# Altium schematic sheet S1_LED_MAT_HDMI.SCHDOC: HDMI Input
size A3; DrawnBy: KSN; Engineer: Dim Su; Revision: 2.0; SheetNumber: 2; SheetTotal: 7; ContentRev1: Original Document; dateREV1: "Aug/09/2018"; dateREV2: "Aug/31/2018"; ContentRev2: ESD circuit changed; Rev1: V1; Rev2: V2; Project: LED_MAT3
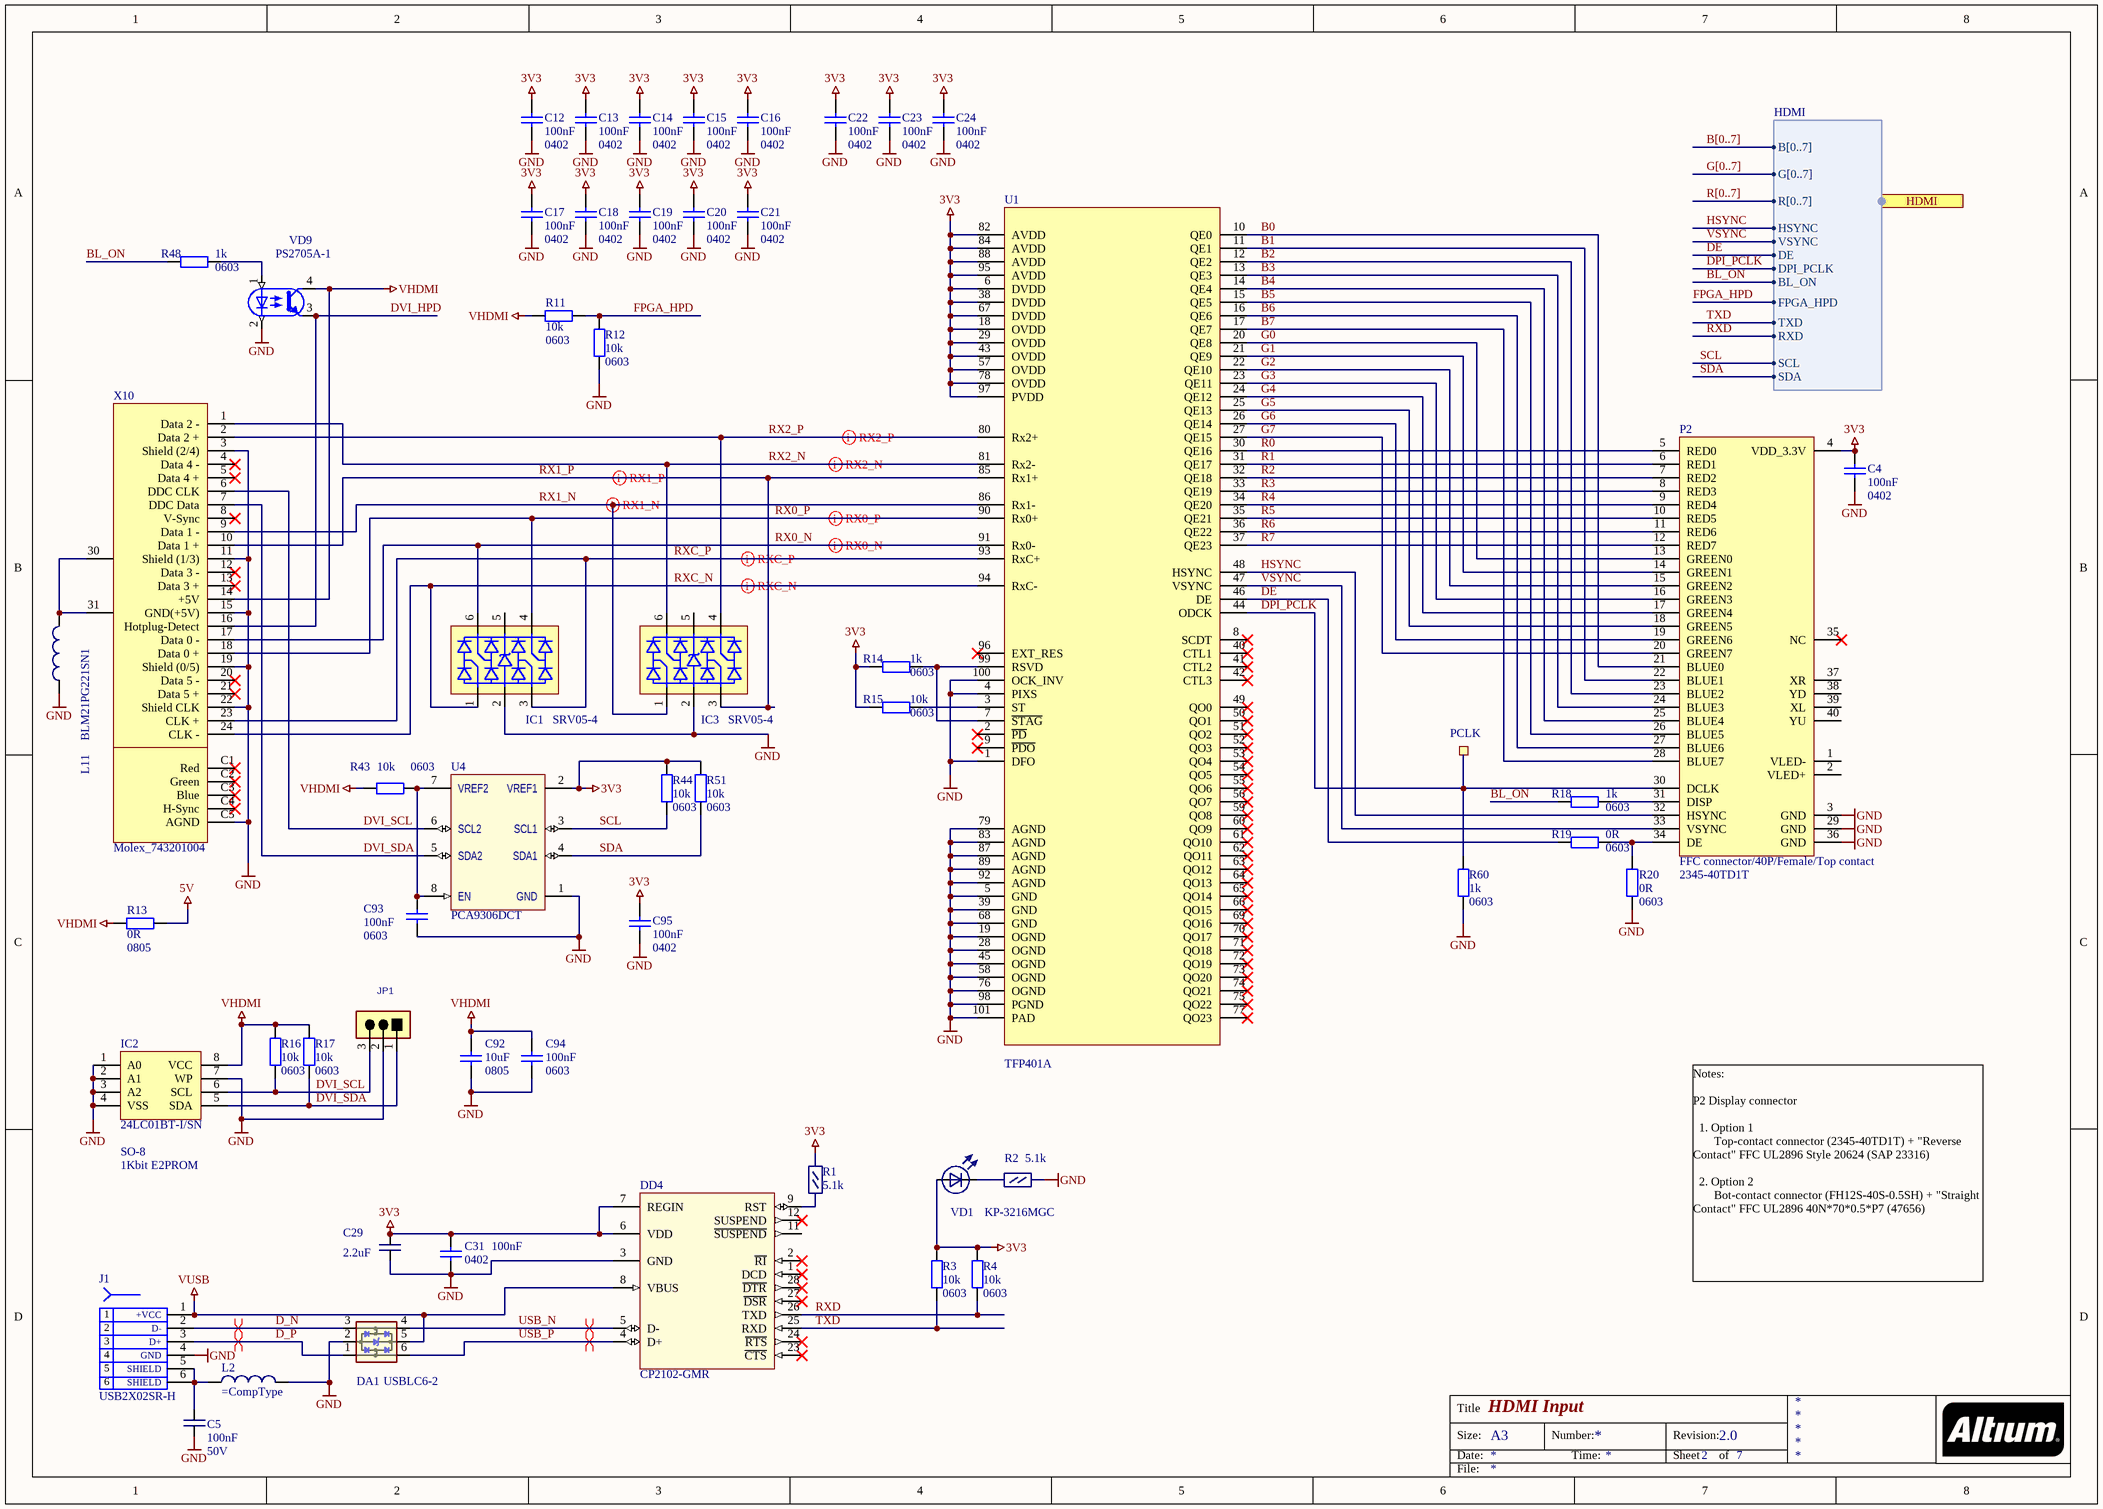
[diagram p0: S1_LED_MAT_HDMI.SCHDOC]

## Parts
C4  value 100nF  Package: 0402  [CAPC1005L]  (hidden comment: 100nF / 0402 / X7R / 16V)
C5  100nF  Voltage: 50V  [CAPC1608L]
C12  value 100nF  Package: 0402  [CAPC1005L]  (hidden comment: 100nF / 0402 / X7R / 16V)
C13  value 100nF  Package: 0402  [CAPC1005L]  (hidden comment: 100nF / 0402 / X7R / 16V)
C14  value 100nF  Package: 0402  [CAPC1005L]  (hidden comment: 100nF / 0402 / X7R / 16V)
C15  value 100nF  Package: 0402  [CAPC1005L]  (hidden comment: 100nF / 0402 / X7R / 16V)
C16  value 100nF  Package: 0402  [CAPC1005L]  (hidden comment: 100nF / 0402 / X7R / 16V)
C17  value 100nF  Package: 0402  [CAPC1005L]  (hidden comment: 100nF / 0402 / X7R / 16V)
C18  value 100nF  Package: 0402  [CAPC1005L]  (hidden comment: 100nF / 0402 / X7R / 16V)
C19  value 100nF  Package: 0402  [CAPC1005L]  (hidden comment: 100nF / 0402 / X7R / 16V)
C20  value 100nF  Package: 0402  [CAPC1005L]  (hidden comment: 100nF / 0402 / X7R / 16V)
C21  value 100nF  Package: 0402  [CAPC1005L]  (hidden comment: 100nF / 0402 / X7R / 16V)
C22  value 100nF  Package: 0402  [CAPC1005L]  (hidden comment: 100nF / 0402 / X7R / 16V)
C23  value 100nF  Package: 0402  [CAPC1005L]  (hidden comment: 100nF / 0402 / X7R / 16V)
C24  value 100nF  Package: 0402  [CAPC1005L]  (hidden comment: 100nF / 0402 / X7R / 16V)
C29  2.2uF  [CAPC2012L]
C31  value 100nF  Package: 0402  [CAPC1005L]  (hidden comment: 100nF / 0402 / X7R / 16V)
C92  value 10uF  Package: 0805  [CAPC2012L]  (hidden comment: 10uF / 0805 /  X5R / 10V)
C93  value 100nF  Package: 0603  [CAPC1608L]  (hidden comment: 100nF / 0603 / X7R / 16V)
C94  value 100nF  Package: 0603  [CAPC1608L]  (hidden comment: 100nF / 0603 / X7R / 16V)
C95  value 100nF  Package: 0402  [CAPC1005L]  (hidden comment: 100nF / 0402 / X7R / 16V)
DA1  USBLC6-2  [SOT95P280X110-6L]
DD4  CP2102-GMR  [QFN50P500X500-28V1N]
IC1  value SRV05-4  [SOT23-6 (DBV)]  (hidden comment: SRV05-4.TCT/5V/300W/TVS Diode Array)
IC2  value 1Kbit E2PROM  Manufacturer Part Number: 24LC01BT-I/SN  Package: SO-8  [SOIC127P600-8N]  (hidden comment: 24LC01B)
IC3  value SRV05-4  [SOT23-6 (DBV)]  (hidden comment: SRV05-4.TCT/5V/300W/TVS Diode Array)
J1  USB2X02SR-H  [USB_B]
JP1  Header 1x3, 2.54mm  [HDR-1x3 SAP 10347]  (value not drawn)
L2  (no value)  [INDC2012L]
L11  BLM21PG221SN1  [INDC2012L]
P2  value FFC connector/40P/Female/Top contact  Manufacturer Part Number: 2345-40TD1T  [OUPIN 2345-40]  (hidden comment: TIANMA_TM043NBH02)
PCLK  Ø1.0mm,SMD  [TP_SMD_1MM]  (value not drawn)  (no BOM)
R1  5.1k  [RESC1608L]
R2  5.1k  [RESC1608L]
R3  value 10k  Package: 0603  [RESC1608L]  (hidden comment: 10k / 1% / 0603 / TC100 / 50V / 0.1W)
R4  value 10k  Package: 0603  [RESC1608L]  (hidden comment: 10k / 1% / 0603 / TC100 / 50V / 0.1W)
R11  value 10k  Package: 0603  [RESC1608L]  (hidden comment: 10k / 1% / 0603 / TC100 / 50V / 0.1W)
R12  value 10k  Package: 0603  [RESC1608L]  (hidden comment: 10k / 1% / 0603 / TC100 / 50V / 0.1W)
R13  value 0R  Package: 0805  [RESC2012L]  (hidden comment: 0R / 2A / 0805/ TC100 / 50V / 0.125W)
R14  value 1k  Package: 0603  [RESC1608L]  (hidden comment: 1k / 1% / 0603 / TC100 / 50V / 0.1W)
R15  value 10k  Package: 0603  [RESC1608L]  (hidden comment: 10k / 1% / 0603 / TC100 / 50V / 0.1W)
R16  value 10k  Package: 0603  [RESC1608L]  (hidden comment: 10k / 1% / 0603 / TC100 / 50V / 0.1W)
R17  value 10k  Package: 0603  [RESC1608L]  (hidden comment: 10k / 1% / 0603 / TC100 / 50V / 0.1W)
R18  value 1k  Package: 0603  [RESC1608L]  (hidden comment: 1k / 1% / 0603 / TC100 / 50V / 0.1W)
R19  value 0R  Package: 0603  [RESC1608L]  (hidden comment: 0R / 1A / 0603 / TC100 / 50V / 0.1W)
R20  value 0R  Package: 0603  [RESC1608L]  (hidden comment: 0R / 1A / 0603 / TC100 / 50V / 0.1W)
R43  value 10k  Package: 0603  [RESC1608L]  (hidden comment: 10k / 1% / 0603 / TC100 / 50V / 0.1W)
R44  value 10k  Package: 0603  [RESC1608L]  (hidden comment: 10k / 1% / 0603 / TC100 / 50V / 0.1W)
R48  value 1k  Package: 0603  [RESC1608L]  (hidden comment: 1k / 1% / 0603 / TC100 / 50V / 0.1W)
R51  value 10k  Package: 0603  [RESC1608L]  (hidden comment: 10k / 1% / 0603 / TC100 / 50V / 0.1W)
R60  value 1k  Package: 0603  [RESC1608L]  (hidden comment: 1k / 1% / 0603 / TC100 / 50V / 0.1W)
U1  TFP401A  [100 LQFP (14x14)]
U4  PCA9306DCT  [TSSOP65-8L - DCT (R-PDSO-G8)]
VD1  KP-3216MGC  [LED3216X10L]
VD9  PS2705A-1  [PS2705A-1]
X10  Molex_743201004  [DVI 29pol / Female Insertion / 90°]

## Ports
HDMI (harness HDMI)

## Harnesses
HDMI: B[0..7], G[0..7], R[0..7], HSYNC, VSYNC, DE, DPI_PCLK, BL_ON, TXD, RXD, SCL, SDA, FPGA_HPD

## Nets
3V3: C4.2 C12.2 C13.2 C14.2 C15.2 C16.2 C17.2 C18.2 C19.2 C20.2 C21.2 C22.2 C23.2 C24.2 C29.1 C31.2 C95.2 DD4.6(VDD) DD4.7(REGIN) P2.4(VDD_3.3V) R1.1 R3.1 R4.1 R14.2 R15.1 R44.1 R51.1 U1.6(DVDD) U1.18(OVDD) U1.29(OVDD) U1.38(DVDD) U1.43(OVDD) U1.57(OVDD) U1.67(DVDD) U1.78(OVDD) U1.82(AVDD) U1.84(AVDD) U1.88(AVDD) U1.95(AVDD) U1.97(PVDD) U4.2(VREF1) VD1.1
5V: R13.1
GND: C4.1 C5.2 C12.1 C13.1 C14.1 C15.1 C16.1 C17.1 C18.1 C19.1 C20.1 C21.1 C22.1 C23.1 C24.1 C29.2 C31.1 C92.2 C93.1 C94.1 C95.1 DA1.2 DD4.3(GND) DD4.29(GND) IC1.2 IC2.1(A0) IC2.2(A1) IC2.3(A2) IC2.4(VSS) IC2.7(WP) IC3.2 J1.4(GND) JP1.2 L2.2 L11.1 P2.0(GND) P2.3(GND) P2.29(GND) P2.36(GND) R2.1 R12.2 R20.1 R60.2 U1.1(DFO) U1.4(PIXS) U1.5(GND) U1.19(OGND) U1.28(OGND) U1.39(GND) U1.45(OGND) U1.58(OGND) U1.68(GND) U1.76(OGND) U1.79(AGND) U1.83(AGND) U1.87(AGND) U1.89(AGND) U1.92(AGND) U1.98(PGND) U1.100(OCK_INV) U1.101(PAD) U4.1(GND) VD9.2(K) X10.3(Shield_(2/4)) X10.11(Shield_(1/3)) X10.15(GND(+5V)) X10.19(Shield_(0/5)) X10.22(Shield_CLK) X10.C5(AGND)
VHDMI: C92.1 C94.2 IC2.8(VCC) R11.1 R13.2 R16.1 R17.1 R43.1 VD9.4 X10.14(+5V)
VUSB: DA1.5 DD4.8(VBUS) J1.1(+VCC)
B0: P2.21(BLUE0) U1.10(QE0)
B1: P2.22(BLUE1) U1.11(QE1)
B2: P2.23(BLUE2) U1.12(QE2)
B3: P2.24(BLUE3) U1.13(QE3)
B4: P2.25(BLUE4) U1.14(QE4)
B5: P2.26(BLUE5) U1.15(QE5)
B6: P2.27(BLUE6) U1.16(QE6)
B7: P2.28(BLUE7) U1.17(QE7)
BL_ON: R18.2 R48.2 ; port HDMI.BL_ON
D_N: DA1.3 J1.2(D-)
D_P: DA1.1 J1.3(D+)
DE: R19.1 U1.46(DE) ; port HDMI.DE
DPI_PCLK: P2.30(DCLK) PCLK.1 R60.1 U1.44(ODCK) ; port HDMI.DPI_PCLK
DVI_HPD: VD9.3 X10.16(Hotplug-Detect)
DVI_SCL: IC2.6(SCL) JP1.3 R16.2 U4.6(SCL2) X10.6(DDC_CLK)
DVI_SDA: IC2.5(SDA) JP1.1 R17.2 U4.5(SDA2) X10.7(DDC_Data)
FPGA_HPD: R11.2 R12.1 ; port HDMI.FPGA_HPD
G0: P2.13(GREEN0) U1.20(QE8)
G1: P2.14(GREEN1) U1.21(QE9)
G2: P2.15(GREEN2) U1.22(QE10)
G3: P2.16(GREEN3) U1.23(QE11)
G4: P2.17(GREEN4) U1.24(QE12)
G5: P2.18(GREEN5) U1.25(QE13)
G6: P2.19(GREEN6) U1.26(QE14)
G7: P2.20(GREEN7) U1.27(QE15)
HSYNC: P2.32(HSYNC) U1.48(HSYNC) ; port HDMI.HSYNC
R0: P2.5(RED0) U1.30(QE16)
R1: P2.6(RED1) U1.31(QE17)
R2: P2.7(RED2) U1.32(QE18)
R3: P2.8(RED3) U1.33(QE19)
R4: P2.9(RED4) U1.34(QE20)
R5: P2.10(RED5) U1.35(QE21)
R6: P2.11(RED6) U1.36(QE22)
R7: P2.12(RED7) U1.37(QE23)
RX0_N: IC1.6 U1.91(Rx0-) X10.17(Data_0_-)
RX0_P: IC1.4 U1.90(Rx0+) X10.18(Data_0_+)
RX1_N: IC3.1(VCC) U1.86(Rx1-) X10.9(Data_1_-)
RX1_P: IC3.3 U1.85(Rx1+) X10.10(Data_1_+)
RX2_N: IC3.6 U1.81(Rx2-) X10.1(Data_2_-)
RX2_P: IC3.4 U1.80(Rx2+) X10.2(Data_2_+)
RXC_N: IC1.1(VCC) U1.94(RxC-) X10.24(CLK_-)
RXC_P: IC1.3 U1.93(RxC+) X10.23(CLK_+)
RXD: DD4.26(TXD) R4.2 ; port HDMI.RXD
SCL: R44.2 U4.3(SCL1) ; port HDMI.SCL
SDA: R51.2 U4.4(SDA1) ; port HDMI.SDA
TXD: DD4.25(RXD) R3.2 ; port HDMI.TXD
USB_N: DA1.4 DD4.5(D-)
USB_P: DA1.6 DD4.4(D+)
VSYNC: P2.33(VSYNC) U1.47(VSYNC) ; port HDMI.VSYNC
NetC5_1: C5.1 J1.5(SHIELD) J1.6(SHIELD) L2.1
NetC93_2: C93.2 R43.2 U4.7(VREF2) U4.8(EN)
NetDD4_9: DD4.9(RST) R1.2
NetL11_2: L11.2 X10.30 X10.31
NetP2_31: P2.31(DISP) R18.1
NetP2_34: P2.34(DE) R19.2 R20.2
NetR2_2: R2.2 VD1.2
NetR14_1: R14.1 U1.7(~{STAG}) U1.99(RSVD)
NetR15_2: R15.2 U1.3(ST)
NetR48_1: R48.1 VD9.1(A)

Not connected (* = marked no-connect by the designer): DD4 1(DCD)* 2(~{RI})* 10(NC) 11(~{SUSPEND}) 12(SUSPEND)* 13(NC) 14(NC) 15(NC) 16(NC) 17(NC) 18(NC) 19(NC) 20(NC) 21(NC) 22(NC) 23(~{CTS})* 24(~{RTS})* 27(~{DSR})* 28(~{DTR})*; IC1 5; IC3 5; P2 1(VLED-) 2(VLED+) 35(NC)* 37(XR) 38(YD) 39(XL) 40(YU); U1 2(~{PD})* 8(SCDT)* 9(~{PDO})* 40(CTL1)* 41(CTL2)* 42(CTL3)* 49(QO0)* 50(QO1)* 51(QO2)* 52(QO3)* 53(QO4)* 54(QO5)* 55(QO6)* 56(QO7)* 59(QO8)* 60(QO9)* 61(QO10)* 62(QO11)* 63(QO12)* 64(QO13)* 65(QO14)* 66(QO15)* 69(QO16)* 70(QO17)* 71(QO18)* 72(QO19)* 73(QO20)* 74(QO21)* 75(QO22)* 77(QO23)* 96(EXT_RES)*; X10 4(Data_4_-)* 5(Data_4_+)* 8(V-Sync)* 12(Data_3_-)* 13(Data_3_+)* 20(Data_5_-)* 21(Data_5_+)* C1(Red)* C2(Green)* C3(Blue)* C4(H-Sync)*

## Buses and harness runs
bus B[0..7]
bus G[0..7]
bus R[0..7]

## Layout directives
differential pair: RX0_N, RX0_P, RX1_N, RX1_P, RX2_N, RX2_P, RXC_N, RXC_P
differential pair; net class Diff_90Ohm: D_N, D_P, USB_N, USB_P

## Notes on the sheet
- Notes:
  P2 Display connector
  1. Option 1
  Top-contact connector (2345-40TD1T) + "Reverse Contact" FFC UL2896 Style 20624 (SAP 23316)
  2. Option 2
  Bot-contact connector (FH12S-40S-0.5SH) + "Straight Contact" FFC UL2896 40N*70*0.5*P7 (47656)
- Title
- Size:
- Date:
- A3
- Number:
- Time:
- Revision:
- Sheet
- of
- File:

## Library data of the parts
C4 C12-C24 C31 C95 = 100nF / 0402 / X7R / 16V: Capacitor ceramic; Manufacturer: SAMSUNG; Manufacturer Part Number: CL05B104KO5NNNC; Voltage: 16V; CompName: Capacitor; Price: 0.2
C5 = Capacitor CC0805 100nF C0G: Capacitor SMD; Manufacturer: SAMSUNG; Manufacturer Part Number: CL21B104KBCNNNC; Tolerance: 5%; CompName: Capacitor; Value: 100nF; Package: 0805; Price: 0.07
C29 = Capacitor CC0805 2.2uF X7R: Capacitor SMD; Manufacturer: TDK; Manufacturer Part Number: C2012X7R1C225K125AB; Voltage: 50V; Tolerance: 20%; CompName: Capacitor; Value: 2.2uF; Package: 0805; Price: 0.63
C92 = 10uF / 0805 /  X5R / 10V: Capacitor ceramic; Voltage: 10V; CompName: Capacitor; Price: 0.2
C93 C94 = 100nF / 0603 / X7R / 16V: Capacitor ceramic; Manufacturer: *; Manufacturer Part Number: *; Voltage: 16V; CompName: Capacitor; Price: 0.2
DA1 = EMC_USBLC6-2SC6: Very low capacitance ESD protection; CompName: IC; Manufacturer: ST; Value: USBLC6-2; Manufacturer Part Number: USBLC6-2SC6; Price: 20
DD4 = CP2102-GM: USB to UART bridge; CompName: IC; Manufacturer: SILICON; Manufacturer Part Number: CP2102-GMR; Package: QFN28; Price: 2; Value: CP2102-GMR
IC1 IC3 = SRV05-4.TCT/5V/300W/TVS Diode Array: Low Capacitance Transient Voltage   Suppressors Diode Array; Manufacturer: SEMTECH; Voltage: 5V; Remarks: ./.; Manufacturer Part Number: SRV05-4.TCT; Temperature: -55°C ~ 125°C; Category: Diode; Price: 9.79; Supplier: Digikey; Supplier Order Code: SRV05-4TR-ND; Package: SOT23-6L
IC2 = 24LC01B: 1K I2C Serial EEPROM; Manufacturer: MICROCHIP; CompName: IC; Temperature: -40ฐC - 85ฐC; Price: 3.21
J1 = CON6_LEFT: USB-B; CompName: Connector; Manufacturer: AUK; Manufacturer Part Number: USB2X02SR-H; Package: USB-B; Price: 3.14; Value: USB2X02SR-H
JP1 = HDR-1x3: Header, 3-Pin; Manufacturer Part Number: 21B1264-03S10-01G-6/3; Manufacturer: JIH VEI; CompName: Connector; Remarks: replaceable; Tolerance: ./.; Category: Header; Package: Header 1x3, 2.54mm; Price: 0.125; Temperature: -40...+85°C; Type: Header 1x3, 2.54mm; Value: Header 1x3, 2.54mm; Voltage: ./.
L2 = INDUCTOR: Ferrite bead; Manufacturer: Murata; Manufacturer Part Number: BLM21PG221SN1; CompName: Inductor; Package: 0805; Price: 0.06
L11 = L0805_BLM21: Ferrite bead; CompName: Inductor; Manufacturer: Murata; Manufacturer Part Number: BLM21PG221SN1; Package: 0805; Price: 0.06
P2 = TIANMA_TM043NBH02: Manufacturer: OUPIIN; CompName: Connector; Price: 1
PCLK = TESTPAD_SMD: circular SMD testpad 1mm; Manufacturer Part Number: *; Value: Ø1.0mm,SMD; Supplier: *; Category: Pattern
R1 R2 = Resistor RC0805 5k1: Resistor SMD; Manufacturer: YAGEO; Manufacturer Part Number: RC0805FR075K1L; Tolerance: 5%; CompName: Resistor; Value: 5.1k; Package: 0805; Price: 0.07
R3 R4 R11 R12 R15-R17 R43 R44 R51 = 10k / 1% / 0603 / TC100 / 50V / 0.1W: Resistor; Tolerance: 1%; Voltage: 50V; CompName: Resistor; Price: 0.02
R13 = 0R / 2A / 0805/ TC100 / 50V / 0.125W: Resistor; Manufacturer: YAGEO; Manufacturer Part Number: RC0805JR-070RL; Remarks: replaceable; Voltage: 50V; CompName: Resistor; Price: 0.02
R14 R18 R48 R60 = 1k / 1% / 0603 / TC100 / 50V / 0.1W: Resistor; Remarks: replaceable; Tolerance: 1%; Voltage: 50V; CompName: Resistor; Price: 0.02
R19 R20 = 0R / 1A / 0603 / TC100 / 50V / 0.1W: Resistor; Manufacturer: YAGEO; Manufacturer Part Number: RC0603FR-070RL; Remarks: replaceable; Voltage: 50V; CompName: Resistor; Price: 0.02
U1 = TFP401A_2: PanelBus DVI Receiver 165MHz, HSYNC fix; Manufacturer: TI; CompName: IC; Package: TQFP-100; Manufacturer Part Number: TFP401A; Price: 7.02
U4 = PCA9306DCTT: Bidirectional Translator; CompName: IC; Manufacturer: TI; Manufacturer Part Number: PCA9306DCT; Package: TSOP-8; Price: 22.5; Type: IC; Value: PCA9306DCT
VD1 = KP-3216MGC: SMD LED GREEN; Manufacturer: KINGBRIGHT; CompName: LED; Manufacturer Part Number: KP-3216MGC; Package: 3216; Price: 3.5; Type: Green
VD9 = PS2701A-1: Photocoupler, SOP package; CompName: IC; Manufacturer: RENESAS; Manufacturer Part Number: PS2705A-1-F3-A; CompKind: 0; Value: PS2705A-1-F3-A; CompType: PS2705A-1; ValueBOM: PS2705A-1; Package: SOP-4; Price: 4.16
X10 = DVI / 29pole / 90°: DVI Connector; Manufacturer: AMTEK; Manufacturer Part Number: DVIR-F29SWND-L; Value: Molex_743201004; Package: DVI / 29pole / 90°; CompName: Connector; Price: 1